# Altium schematic sheet Logic_Level_Output.SchDoc
size A; SheetNumber: 6; SheetTotal: 8
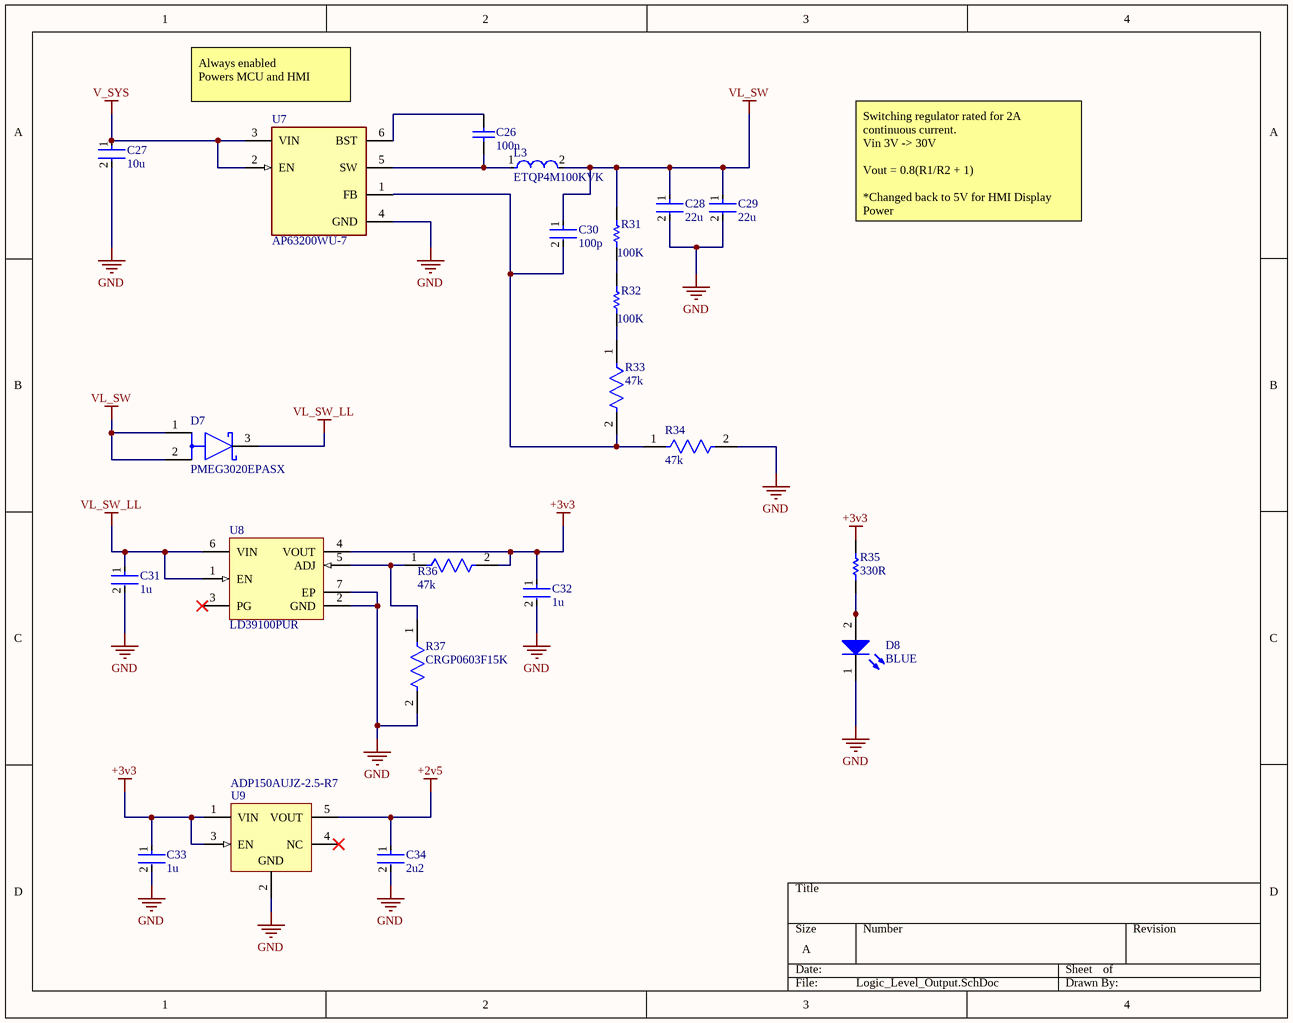
[diagram p0: Logic_Level_Output.SchDoc]

## Parts
C26  100n  [CAPC1608X90X35NL15T15]
C27  10u  [FP-C0805X106K8RACAUTO-MFG]
C28  22u  [FP-C0805C226M8PACTU-MFG]
C29  22u  [FP-C0805C226M8PACTU-MFG]
C30  100p  [FP-C0603C-CF-MFG]
C31  1u  [FP-0603-L_1_6_0_15-W_0_81-IPC_A]
C32  1u  [FP-0603-L_1_6_0_15-W_0_81-IPC_A]
C33  1u  [FP-0603-L_1_6_0_15-W_0_81-IPC_A]
C34  2u2  [FP-CC0603-DC-MFG]
D7  PMEG3020EPASX  [FP-SOT1061D-MFG]
D8  BLUE  [WL-SMCW_0603_150060xx75000]
L3  ETQP4M100KVK  [FP-PCC-M0840M-LP-MFG]
R31  100K  [RESC0603(1608)_N]
R32  100K  [RESC0603(1608)_N]
R33  47k  [FP-AT0603-MFG]
R34  47k  [FP-AT0603-MFG]
R35  330R  [RESC1608X55X25NL10T15]
R36  47k  [FP-AT0603-MFG]
R37  CRGP0603F15K  [FP-CRGP0603-IPC_C]
U7  AP63200WU-7  [FP-TSOT26-MFG]
U8  LD39100PUR  [DFN6D_M]
U9  ADP150AUJZ-2.5-R7  [ADI-UJ-5_N]

## Nets
+2v5: C34.1 U9.5(VOUT)
+3v3: C32.1 C33.1 R35.2 R36.2 U8.4(VOUT) U9.1(VIN) U9.3(EN)
GND: C27.2 C28.2 C29.2 C31.2 C32.2 C33.2 C34.2 D8.1(K) R34.2 R37.2 U7.4(GND) U8.2(GND) U8.7(EP) U9.2(GND)
V_SYS: C27.1 U7.2(EN) U7.3(VIN)
VL_SW: C28.1 C29.1 C30.1 D7.1(A) D7.2(A) L3.2 R31.2
VL_SW_LL: C31.1 D7.3(C) U8.1(EN) U8.6(VIN)
NetC26_1: C26.1 L3.1 U7.5(SW)
NetC26_2: C26.2 U7.6(BST)
NetC30_2: C30.2 R33.2 R34.1 U7.1(FB)
NetD8_2: D8.2(A) R35.1
NetR31_1: R31.1 R32.2
NetR32_1: R32.1 R33.1
NetR36_1: R36.1 R37.1 U8.5(ADJ)

Not connected (* = marked no-connect by the designer): U8 3(PG)*; U9 4(NC)*

## Notes on the sheet
- (near U7) Always enabled
  Powers MCU and HMI
- Switching regulator rated for 2A continuous current.
  Vin 3V -> 30V
  Vout = 0.8(R1/R2 + 1)
  *Changed back to 5V for HMI Display Power

## Library data of the parts
C26 = CMP-2006-02299-1: Part Number: C0603C104K4RAC7013; Manufacturer: Kemet
C27 = CMP-03020-034694-1: CAP CER 10UF 10V X7R 0805; Tolerance: 10%; Case/Package: 0805; Min Operating Temperature: -55°C; Max Operating Temperature: 125°C; RoHS Compliant: Yes; Ratings: AEC-Q200; Mount: Surface Mount; Features: Soft Termination; Capacitance: 10uF; Packaging: Cut Tape; Case Code (Metric): 2012; Voltage Rating: 10V; Case Code (Imperial): 0805
C28 C29 = CMP-03020-034697-1: CAP CER 22UF 10V X5R 0805; Tolerance: 20%; Dissipation Factor: 10%; Dielectric Material: Ceramic; Termination: Solder; Case Code (Imperial): 0805; Packaging: Tape and Reel; Height: 1.25mm; Voltage: 10V; Case Code (Metric): 2012; Case/Package: 0805; Width: 0.049inch; Capacitance: 22uF; Length: 0.079inch; Depth: 1.25mm; RoHS Compliant: Yes; Voltage Rating (DC): 10V; Lead Free: Lead Free; Dielectric: X5R; Thickness: 0.055inch; Mount: Surface Mount; Voltage Rating: 10V; Max Operating Temperature: 85°C; Min Operating Temperature: -55°C
C30 = CMP-03020-026556-1: CAP CER 100PF 10V X7R 0603; Manufacturer: KEMET; Manufacturer Part Number: C0603C101K8RAC7867; Material: Ceramic; Temperature Coefficient: 30ppm/°C; Automotive Grade: Grade 1; Tolerance: 0.1; RoHS: TRUE; Lead Free: Yes; Octopart: https://octopart.com/c0603c101k8rac7867-kemet-83501928; Device Class L1: Passive Components; ComponentLink2URL: https://api.kemet.com/component-edge/download/datasheet/C0603C100J5GACAUTO.pdf; Value: 100 pF; Digikey Description: CAP CER 100PF 10V X7R 0603; Package: C0603C-CF; Voltage Rating: 10 V; Height: 0.87mm; Temperature: -55°C to +125°C; Temperature Range High: +125°C; Device Class L3: Ceramic Capacitors; Capacitance: 100 pF; ComponentLink2Description: Datasheet; Temperature Range Low: -55°C; Category: Cap; Temperature Characteristic: X7R; Device Class L2: Capacitors; Automotive: Yes
C31-C33 = CMP-2006-04474-2: General Purpose Ceramic Capacitor, 0603, 1uF, 10%, X5R, 15%, 6.3V; Insulation Resistance: 100GR; Dissipation Factor: 5%; Package Quantity: 1; Mount: Surface Mount; Series: -; Number of Pins: 2; Length: 1.6mm; RoHS Compliant: Yes; Capacitance: 1uF; Depth: 0.81mm; Case Code (Imperial): 0603; Lead Free: Lead Free; Max Operating Temperature: 85°C; Case Code (Metric): 1608; Min Operating Temperature: -55°C; Contact Plating: Tin; Voltage: 6.3V; Tolerance: 10%; Width: 0.032inch; Voltage Rating (DC): 6.3V; Voltage Rating: 6.3V; Termination: SMD/SMT; Radiation Hardening: No; Case/Package: 0603; Thickness: 0.035inch; Height: 0.9mm; REACH SVHC: No SVHC; Packaging: Tape and Reel; Construction: Flat; Dielectric: X5R
C34 = CMP-03422-000578-2: CAP CER 2.2UF 50V X5R 0603; Tolerance: 10%; Packaging: Cut Tape; Capacitance: 2.2uF; Min Operating Temperature: -55°C; RoHS Compliant: Yes; Max Operating Temperature: 85°C; Case Code (Metric): 1608; Voltage Rating: 50V; Case/Package: 0603; Case Code (Imperial): 0603; Mount: Surface Mount
D7 = CMP-14398-000019-1: DIODE SCHOTTKY 30V 2A SOT1061
D8 = CMP-1426-00003-4: Led, Blue, 470 Nm, 3.2 V, 30 Ma, 145 Mcd Rohs Compliant: Yes; Peak Wavelength: 465nm; Dominant Wavelength: 470nm; Power Dissipation: 105mW; Viewing Angle: 140°; Test Current: 20mA; Max Junction Temperature (Tj): 95°C; Forward Current: 100mA; Reverse Voltage: 5V; Luminous Intensity: 145mcd; Lens Style: Clear, Rectangular; Forward Voltage: 3.2V; RoHS: Compliant; Min Operating Temperature: -40°C; REACH SVHC: Unknown; Max Operating Temperature: 85°C; Width: 800µm; Case Code (Imperial): 0603; Case Code (Metric): 1608; Max Reverse Voltage (DC): 5V; Height: 700µm; Case/Package: 0603; Mount: Surface Mount; Packaging: Tape and Reel; Color: Blue; Wavelength: 470nm; Length: 1.6mm
L3 = CMP-05439-000002-1: FIXED IND 10UH 5.2A 45.76 MOHM; Manufacturer: Panasonic; Saturation Current: 9.1A; Automotive Grade: Grade 0; Shielding: true; Series Resistance: 45.76mΩ; Test Frequency: 100kHz; Rms Current: 4.4A; Core Material: Metal Composite; Tolerance: 20%; Standoff Height: 0.05mm; Device Class L2: Inductors; ComponentLink2URL: https://industrial.panasonic.com/cdbs/www-data/pdf/AGL0000/AGL0000C63.pdf; Value: 10uH; Lead Free: Yes; Octopart: https://octopart.com/etqp4m100kvk-panasonic-71577993; RoHS: TRUE; Digikey Description: FIXED IND 10UH 5.2A 45.76 MOHM; Device Class L1: Passive Components; Temperature Range Low: -55°C; Temperature Range High: +155°C; Height: 4mm; Automotive: Yes; Category: Ind; Manufacturer Part Number: ETQP4M100KVK; Inductance: 10uH; Device Class L3: Fixed Inductors; Package: PCC-M0840M-LP; Temperature: -55°C to +155°C; ComponentLink2Description: Datasheet
R31 R32 = CMP-1012-00736-1: 100K 0.1W 1% 0603 (1608 Metric)  SMD; Value: 100000.00 Ohm; Case-Metric: 1608; Case-EIA: 0603; Power: 0.1 W; Tolerance: 1 %; Technology: SMT
R33 R34 R36 = CMP-03412-020972-2: Thin Film Chip Resistors Automotive Grade 47kΩ 1% 50ppm/°C 0603; Max Power Dissipation: 100mW; Resistance: 47kR; Series: AT; Case/Package: 0603; Temperature Coefficient: 50ppm/°C; Length: 0.063inch; Number of Terminations: 2; Width: 0.032inch; Tolerance: 1%; Min Operating Temperature: -55°C; Features: Moisture Resistant; Resistor Type: Thin Film; RoHS Compliant: Yes; Case Code (Imperial): 0603; Packaging: Cut Tape; Height: 0.022inch; Ratings: AEC-Q200; Case Code (Metric): 1608; Max Operating Temperature: 155°C
R35 = CMP-1659-00020-2: Chip Resistor, 330 Ohm, +/- 1%, 0.1 W, -55 to 155 degC, 0603 (1608 Metric), RoHS, Tape and Reel; Tolerance: 10%; ESR: 800 mohm; Voltage Rating (DC): 16 V; Capacitance: 47 uF; Length: 7.3 mm; ComponentLink1URL: http://www.yageo.com/; Packaging: Tape and Reel; Pins: 2; ComponentLink1Description: Manufacturer URL; Case Code (Imperial): 2917; REACH SVHC: No SVHC; Width: 4.3 mm; ComponentLink2Description: Datasheet; Voltage Rating: 16 V; RoHSCompliant: True; Max Operating Temperature: 125degC; ComponentLink2URL: http://www.yageo.com/documents/recent/PYu-RC_Group_51_RoHS_L_04.pdf; Min Operating Temperature: -55degC; Case/Package: 2917; Radiation Hardening: No; DatasheetVersion: Rev. 4, 02/2016; Mount: Surface Mount; PackageReference: 0603; Package Quantity: 500; Case Code (Metric): 7343; PackageDescription: 2-Pin Surface Mount Device, Body 1.6 x 0.8 mm; Height: 3.1 mm
R37 = CMP-03211-008902-1: CRGP0603 15KΩ 0.25W ±100ppm/°C 1% 50V; Manufacturer: TE; Tolerance: 0.01; Device Class L2: Resistors; ComponentLink2URL: https://www.te.com/commerce/DocumentDelivery/DDEController?Action=srchrtrv&DocNm=9-1773463-9&DocType=DS&DocLang=English; Composition: Thick Film; Device Class L3: Chip SMD Resistors; Manufacturer Part Number: CRGP0603F15K; Power Rating: 0.25W; Ambient Temperature Range High: +70°C; Package: CRGP0603; Device Class L1: Passive Components; Value: 15KΩ; Temperature Range Low: -55°C; Resistance: 15KΩ; Temperature Range High: +155°C; Voltage Rating: 50V; Category: Res; Octopart: https://octopart.com/crgp0603f15k-te+connectivity-91018729; Ipc Land Pattern Name: RESC16080X45; Series: CRGP; ComponentLink2Description: Datasheet; Height: 0.55mm; RoHS: TRUE; Temperature Coefficient: ±100ppm/°C; Automotive: No; Temperature: -55°C to +155°C; Lead Free: Yes
U7 = CMP-12757-000010-1: IC REG BUCK ADJUSTABLE 2A TSOT26; Manufacturer: Diodes Inc.; Switching Frequency: 500kHz; Max Supply Voltage: 32V; Number Of Outputs: 1; Nominal Supply Current: 22uA; Min Supply Voltage: 3.8V; Output Type: AdjustableProgrammable; Max Junction Temp: +160°C; Standoff Height: 0.01mm; Octopart: https://octopart.com/ap63200wu-7-diodes+inc.-98099548; Height: 1mm; Temperature Range Low: -40°C; Output Current: 2A; ComponentLink2URL: https://www.diodes.com/assets/Datasheets/AP63200-AP63201-AP63203-AP63205.pdf; Switching Topology: Buck; Automotive: No; Device Class L1: Integrated Circuits (ICs); Ipc Land Pattern Name: SOT95P280X100-6; Package: TSOT26; Temperature Range High: +85°C; RoHS: TRUE; Ambient Temperature Range High: +85°C; Device Class L3: Voltage Regulators - Switching; Temperature: -40°C to +85°C; Device Class L2: Power Management ICs; Footprint Url: https://www.diodes.com/assets/Package-Files/TSOT26.pdf; Mouser Description: AP63200 Series 1.2 V 2 A Adjustable Synchronous Buck Converter - TSOT-26; Category: IC; ComponentLink2Description: Datasheet; Digikey Description: IC REG BUCK ADJUSTABLE 2A TSOT26; Lead Free: Yes; Ambient Temperature Range Low: -40°C; Manufacturer Part Number: AP63200WU-7
U8 = CMP-0244-00287-1: 1 A Low Quiescent Current Low Noise Voltage Regulator, Adjustable from 0.8V, 6-Pin VFDFPN, Tape and Reel; ComponentLink1URL: http://www.st.com; ComponentLink1Description: Manufacturer URL; ComponentLink2Description: Datasheet; DatasheetVersion: 1/10/2011; PackageDescription: 6-Pin Plastic, Dual LLP, 3 x 3 mm Body, 0.95 mm Pitch, Exposed Pad; PackageReference: DFN6D; ComponentLink2URL: http://www.st.com/internet/com/TECHNICAL_RESOURCES/TECHNICAL_LITERATURE/DATASHEET/CD00233788.pdf; PackageVersion: 2008
U9 = CMP-0786-00375-1: Ultralow Noise, 150 mA CMOS Linear Regulator, 2.2 to 5.5 V Vin, 2.5 V Vout, Industrial, 5-pin SOT23 (UJ-5), Reel; Manufacturer: Analog Devices; Iout max: 150mA; Preset Vout Values (V): 2.5; Supply Current IGND @ Small Load: 10uA; Vin (max) (V): 5.5; Vin (min) (V): 2.2; ComponentLink1URL: http://www.analog.com/en/index.html; ComponentLink2Description: Datasheet; ComponentLink4URL: Product URL:http://www.analog.com/en/ADP150/productSearch.html; ComponentLink3Description: Package Specification; PackageDescription: 5-Pin Thin Small Outline Transistor Package, Body 2.9 x 1.6 mm, Pitch 0.95 mm; PackageReference: UJ-5; ComponentLink3URL: http:/www.analog.com/static/imported-files/packages/PKG_PDF/TSOT(UJ)/UJ_5.pdf; Packing: Reel; ComponentLink4Description: URL Link1; ComponentLink2URL: http://www.analog.com/static/imported-files/data_sheets/ADP150.pdf; Code_JEDEC: MO-193-AB; DatasheetVersion: Rev. A; PackageVersion: 100708-A, 10/2008; ComponentLink1Description: Manufacturer URL; Mounting Technology: Surface Mount; PartNumber: ADP150AUJZ-2.5-R7